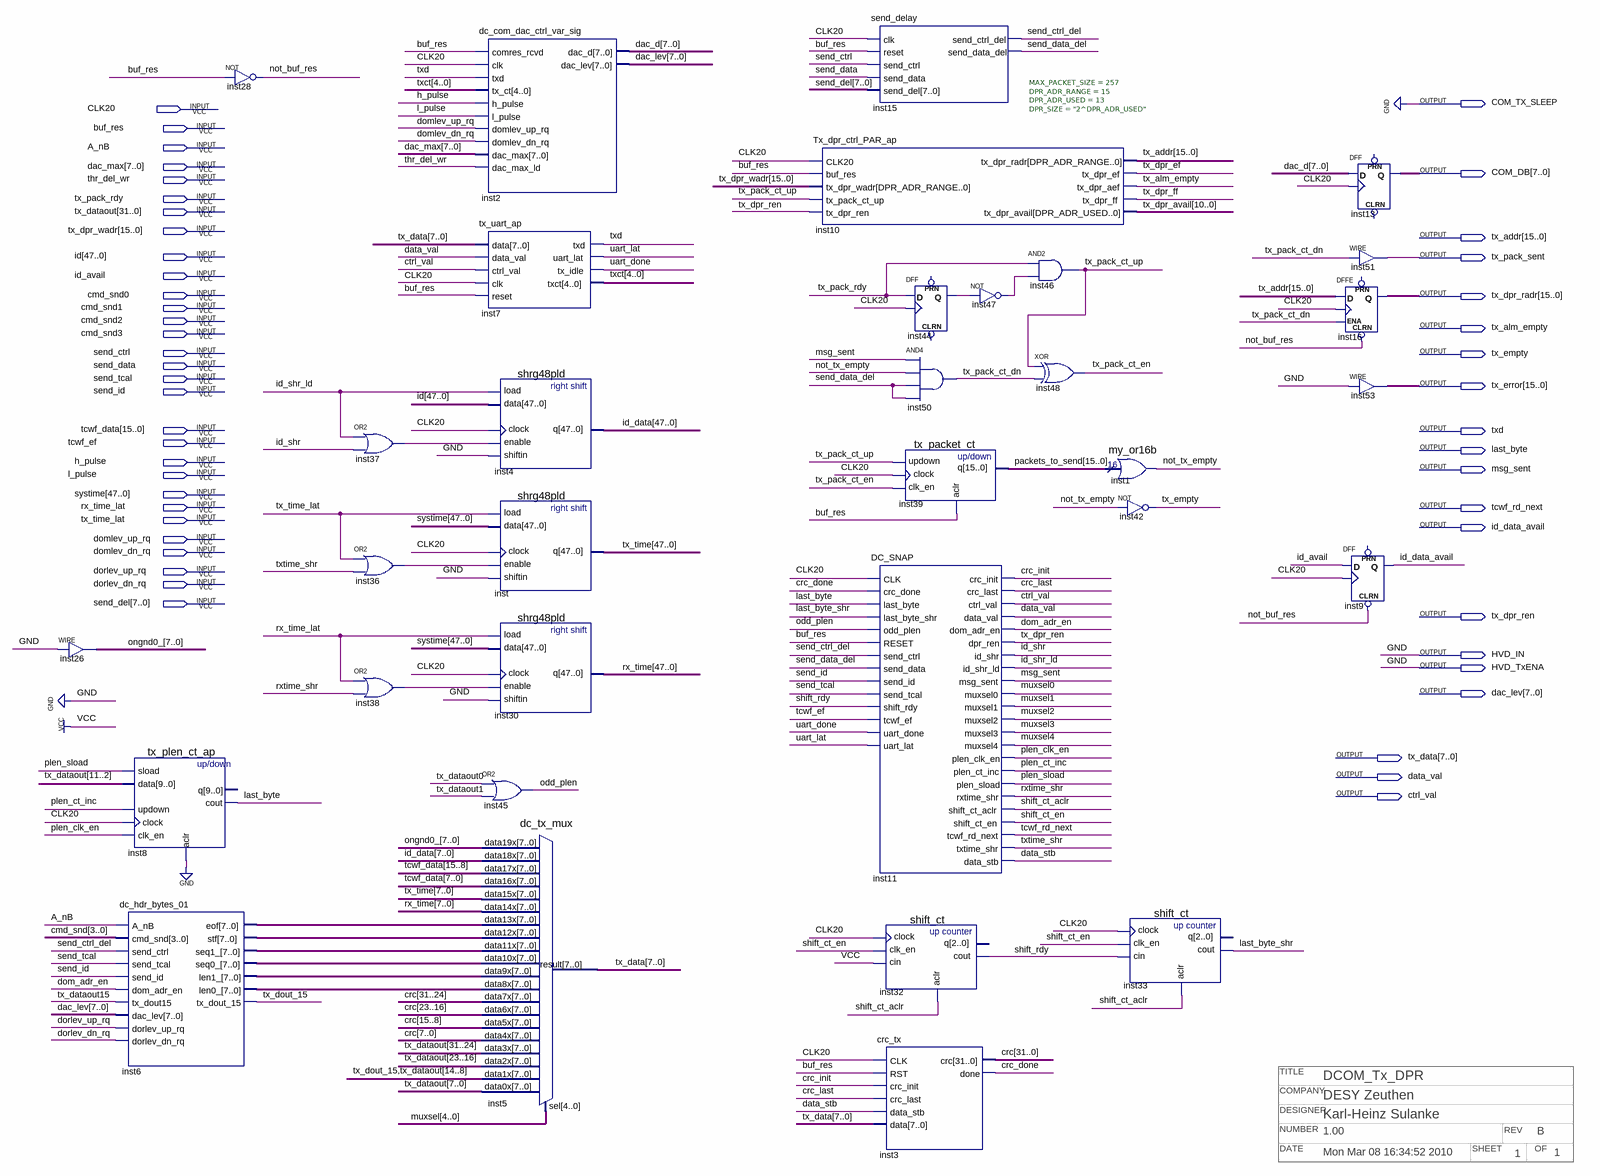
[diagram p0: schematic sheet]
// Quartus schematic DC_Tx_chan_ap.bdf as structural Verilog: 33 symbols, 50 pins
// Title block: TITLE: DCOM_Tx_DPR; COMPANY: DESY Zeuthen; DESIGNER: Karl-Heinz Sulanke; NUMBER: 1.00; REV: B; DATE: Mon Mar 08 16:34:52 2010; SHEET: 1; OF: 1
module DC_Tx_chan_ap (
  input  CLK20,
  input  buf_res,
  input  A_nB,
  input  [7:0] dac_max,
  input  thr_del_wr,
  input  tx_pack_rdy,
  input  [31:0] tx_dataout,
  input  [15:0] tx_dpr_wadr,
  input  [47:0] id,
  input  id_avail,
  input  cmd_snd0,
  input  cmd_snd1,
  input  cmd_snd2,
  input  cmd_snd3,
  input  send_ctrl,
  input  send_data,
  input  send_tcal,
  input  send_id,
  input  [15:0] tcwf_data,
  input  tcwf_ef,
  input  h_pulse,
  input  l_pulse,
  input  [47:0] systime,
  input  rx_time_lat,
  input  tx_time_lat,
  input  domlev_up_rq,
  input  domlev_dn_rq,
  input  dorlev_up_rq,
  input  dorlev_dn_rq,
  input  [7:0] send_del,
  output COM_TX_SLEEP,
  output [7:0] COM_DB,
  output [15:0] tx_addr,
  output tx_pack_sent,
  output [15:0] tx_dpr_radr,
  output tx_alm_empty,
  output tx_empty,
  output [15:0] tx_error,
  output txd,
  output last_byte,
  output msg_sent,
  output tcwf_rd_next,
  output id_data_avail,
  output tx_dpr_ren,
  output HVD_IN,
  output HVD_TxENA,
  output [7:0] dac_lev,
  output [7:0] tx_data,
  output data_val,
  output ctrl_val
);

  wire crc_done, crc_init, crc_last, data_stb, dom_adr_en, id_shr, id_shr_ld, inst36_out, inst37_out,
       inst38_out, inst44_q, inst47_out, last_byte_shr, not_buf_res, not_tx_empty, odd_plen, plen_clk_en,
       plen_ct_inc, plen_sload, rxtime_shr, send_ctrl_del, send_data_del, shift_ct_aclr, shift_ct_en,
       shift_rdy, tx_dout_15, tx_dpr_ef, tx_dpr_ff, tx_pack_ct_dn, tx_pack_ct_en, tx_pack_ct_up, txtime_shr,
       uart_done, uart_lat;
  wire [4:0] muxsel, txct;
  wire [7:0] dac_d, inst6_eof, inst6_len0_, inst6_len1_, inst6_seq0_, inst6_seq1_, inst6_stf, ongnd0_;
  wire [10:0] tx_dpr_avail;
  wire [15:0] packets_to_send;
  wire [31:0] crc;
  wire [47:0] id_data, rx_time, tx_time;

  assign ongnd0_ = {8{1'b0}};  // WIRE inst26
  tx_plen_ct_ap inst8 (
    .sload(plen_sload), .data(tx_dataout[11:2]), .updown(plen_ct_inc), .clock(CLK20), .clk_en(plen_clk_en),
    .aclr(1'b0), .cout(last_byte));  // open: q
  dc_hdr_bytes_01 inst6 (
    .A_nB(A_nB), .cmd_snd({cmd_snd3, cmd_snd2, cmd_snd1, cmd_snd0}), .send_ctrl(send_ctrl_del),
    .send_tcal(send_tcal), .send_id(send_id), .dom_adr_en(dom_adr_en), .tx_dout15(tx_dataout[15]),
    .dac_lev(dac_lev), .dorlev_up_rq(dorlev_up_rq), .dorlev_dn_rq(dorlev_dn_rq), .eof(inst6_eof),
    .stf(inst6_stf), .seq1_(inst6_seq1_), .seq0_(inst6_seq0_), .len1_(inst6_len1_), .len0_(inst6_len0_),
    .tx_dout_15(tx_dout_15));
  not inst28 (not_buf_res, buf_res);
  or inst37 (inst37_out, id_shr_ld, id_shr);
  or inst36 (inst36_out, tx_time_lat, txtime_shr);
  or inst38 (inst38_out, rx_time_lat, rxtime_shr);
  dc_com_dac_ctrl_var_sig inst2 (
    .comres_rcvd(buf_res), .clk(CLK20), .txd(txd), .tx_ct(txct), .h_pulse(h_pulse), .l_pulse(l_pulse),
    .domlev_up_rq(domlev_up_rq), .domlev_dn_rq(domlev_dn_rq), .dac_max(dac_max), .dac_max_ld(thr_del_wr),
    .dac_d(dac_d), .dac_lev(dac_lev));
  tx_uart_ap inst7 (
    .data(tx_data), .data_val(data_val), .ctrl_val(ctrl_val), .clk(CLK20), .reset(buf_res), .txd(txd),
    .uart_lat(uart_lat), .tx_idle(uart_done), .txct(txct));
  or inst45 (odd_plen, tx_dataout[0], tx_dataout[1]);
  dc_tx_mux inst5 (
    .data19x(ongnd0_), .data18x(id_data[7:0]), .data17x(tcwf_data[15:8]), .data16x(tcwf_data[7:0]),
    .data15x(tx_time[7:0]), .data14x(rx_time[7:0]), .data13x(inst6_eof), .data12x(inst6_stf),
    .data11x(inst6_seq1_), .data10x(inst6_seq0_), .data9x(inst6_len1_), .data8x(inst6_len0_),
    .data7x(crc[31:24]), .data6x(crc[23:16]), .data5x(crc[15:8]), .data4x(crc[7:0]),
    .data3x(tx_dataout[31:24]), .data2x(tx_dataout[23:16]), .data1x({tx_dout_15, tx_dataout[14:8]}),
    .data0x(tx_dataout[7:0]), .sel(muxsel), .result(tx_data));
  shrg48pld inst4 (.load(id_shr_ld), .data(id), .clock(CLK20), .enable(inst37_out), .shiftin(1'b0), .q(id_data));
  shrg48pld inst (.load(tx_time_lat), .data(systime), .clock(CLK20), .enable(inst36_out), .shiftin(1'b0), .q(tx_time));
  shrg48pld inst30 (
    .load(rx_time_lat), .data(systime), .clock(CLK20), .enable(inst38_out), .shiftin(1'b0), .q(rx_time));
  Tx_dpr_ctrl_PAR_ap #(.MAX_PACKET_SIZE(257), .DPR_ADR_RANGE(15), .DPR_ADR_USED(13), .DPR_SIZE("2^DPR_ADR_USED")) inst10 (
    .CLK20(CLK20), .buf_res(buf_res), .tx_dpr_wadr(tx_dpr_wadr), .tx_pack_ct_up(tx_pack_ct_up),
    .tx_dpr_ren(tx_dpr_ren), .tx_dpr_radr(tx_addr), .tx_dpr_ef(tx_dpr_ef), .tx_dpr_aef(tx_alm_empty),
    .tx_dpr_ff(tx_dpr_ff), .tx_dpr_avail(tx_dpr_avail));
  send_delay inst15 (
    .clk(CLK20), .reset(buf_res), .send_ctrl(send_ctrl), .send_data(send_data), .send_del(send_del),
    .send_ctrl_del(send_ctrl_del), .send_data_del(send_data_del));
  tx_packet_ct inst39 (
    .updown(tx_pack_ct_up), .clock(CLK20), .clk_en(tx_pack_ct_en), .aclr(buf_res), .q(packets_to_send));
  DC_SNAP inst11 (
    .CLK(CLK20), .crc_done(crc_done), .last_byte(last_byte), .last_byte_shr(last_byte_shr),
    .odd_plen(odd_plen), .RESET(buf_res), .send_ctrl(send_ctrl_del), .send_data(send_data_del),
    .send_id(send_id), .send_tcal(send_tcal), .shift_rdy(shift_rdy), .tcwf_ef(tcwf_ef),
    .uart_done(uart_done), .uart_lat(uart_lat), .crc_init(crc_init), .crc_last(crc_last),
    .ctrl_val(ctrl_val), .data_val(data_val), .dom_adr_en(dom_adr_en), .dpr_ren(tx_dpr_ren), .id_shr(id_shr),
    .id_shr_ld(id_shr_ld), .msg_sent(msg_sent), .muxsel0(muxsel[0]), .muxsel1(muxsel[1]),
    .muxsel2(muxsel[2]), .muxsel3(muxsel[3]), .muxsel4(muxsel[4]), .plen_clk_en(plen_clk_en),
    .plen_ct_inc(plen_ct_inc), .plen_sload(plen_sload), .rxtime_shr(rxtime_shr),
    .shift_ct_aclr(shift_ct_aclr), .shift_ct_en(shift_ct_en), .tcwf_rd_next(tcwf_rd_next),
    .txtime_shr(txtime_shr), .data_stb(data_stb));
  shift_ct inst32 (.clock(CLK20), .clk_en(shift_ct_en), .cin(1'b1), .aclr(shift_ct_aclr), .cout(shift_rdy));  // open: q
  crc_tx inst3 (
    .CLK(CLK20), .RST(buf_res), .crc_init(crc_init), .crc_last(crc_last), .data_stb(data_stb),
    .data(tx_data), .crc(crc), .done(crc_done));
  DFF inst44 (.CLK(CLK20), .D(tx_pack_rdy), .Q(inst44_q));  // open: CLRN, PRN
  and inst50 (tx_pack_ct_dn, msg_sent, not_tx_empty, send_data_del, send_data_del);
  not inst47 (inst47_out, inst44_q);
  and inst46 (tx_pack_ct_up, tx_pack_rdy, inst47_out);
  xor inst48 (tx_pack_ct_en, tx_pack_ct_up, tx_pack_ct_dn);
  my_or16b inst1 (.data(packets_to_send), .result(not_tx_empty));
  not inst42 (tx_empty, not_tx_empty);
  shift_ct inst33 (
    .clock(CLK20), .clk_en(shift_ct_en), .cin(shift_rdy), .aclr(shift_ct_aclr), .cout(last_byte_shr));  // open: q
  DFF inst13[7:0] (.CLK(CLK20), .D(dac_d), .Q(COM_DB));  // open: CLRN, PRN
  assign tx_pack_sent = tx_pack_ct_dn;  // WIRE inst51
  DFFE inst16[15:0] (.CLRN(not_buf_res), .D(tx_addr), .CLK(CLK20), .ENA(tx_pack_ct_dn), .Q(tx_dpr_radr));  // open: PRN
  assign tx_error = {16{1'b0}};  // WIRE inst53
  DFF inst9 (.CLRN(not_buf_res), .CLK(CLK20), .D(id_avail), .Q(id_data_avail));  // open: PRN

  assign COM_TX_SLEEP = 1'b0;
  assign HVD_IN = 1'b0;
  assign HVD_TxENA = 1'b0;
endmodule
